# EAGLE design Nixieclock (EAGLE 7.2.0)
CNAME: http://niekproductions.com/; CREVISION: 1.0; DESIGNER: Niek Blankers
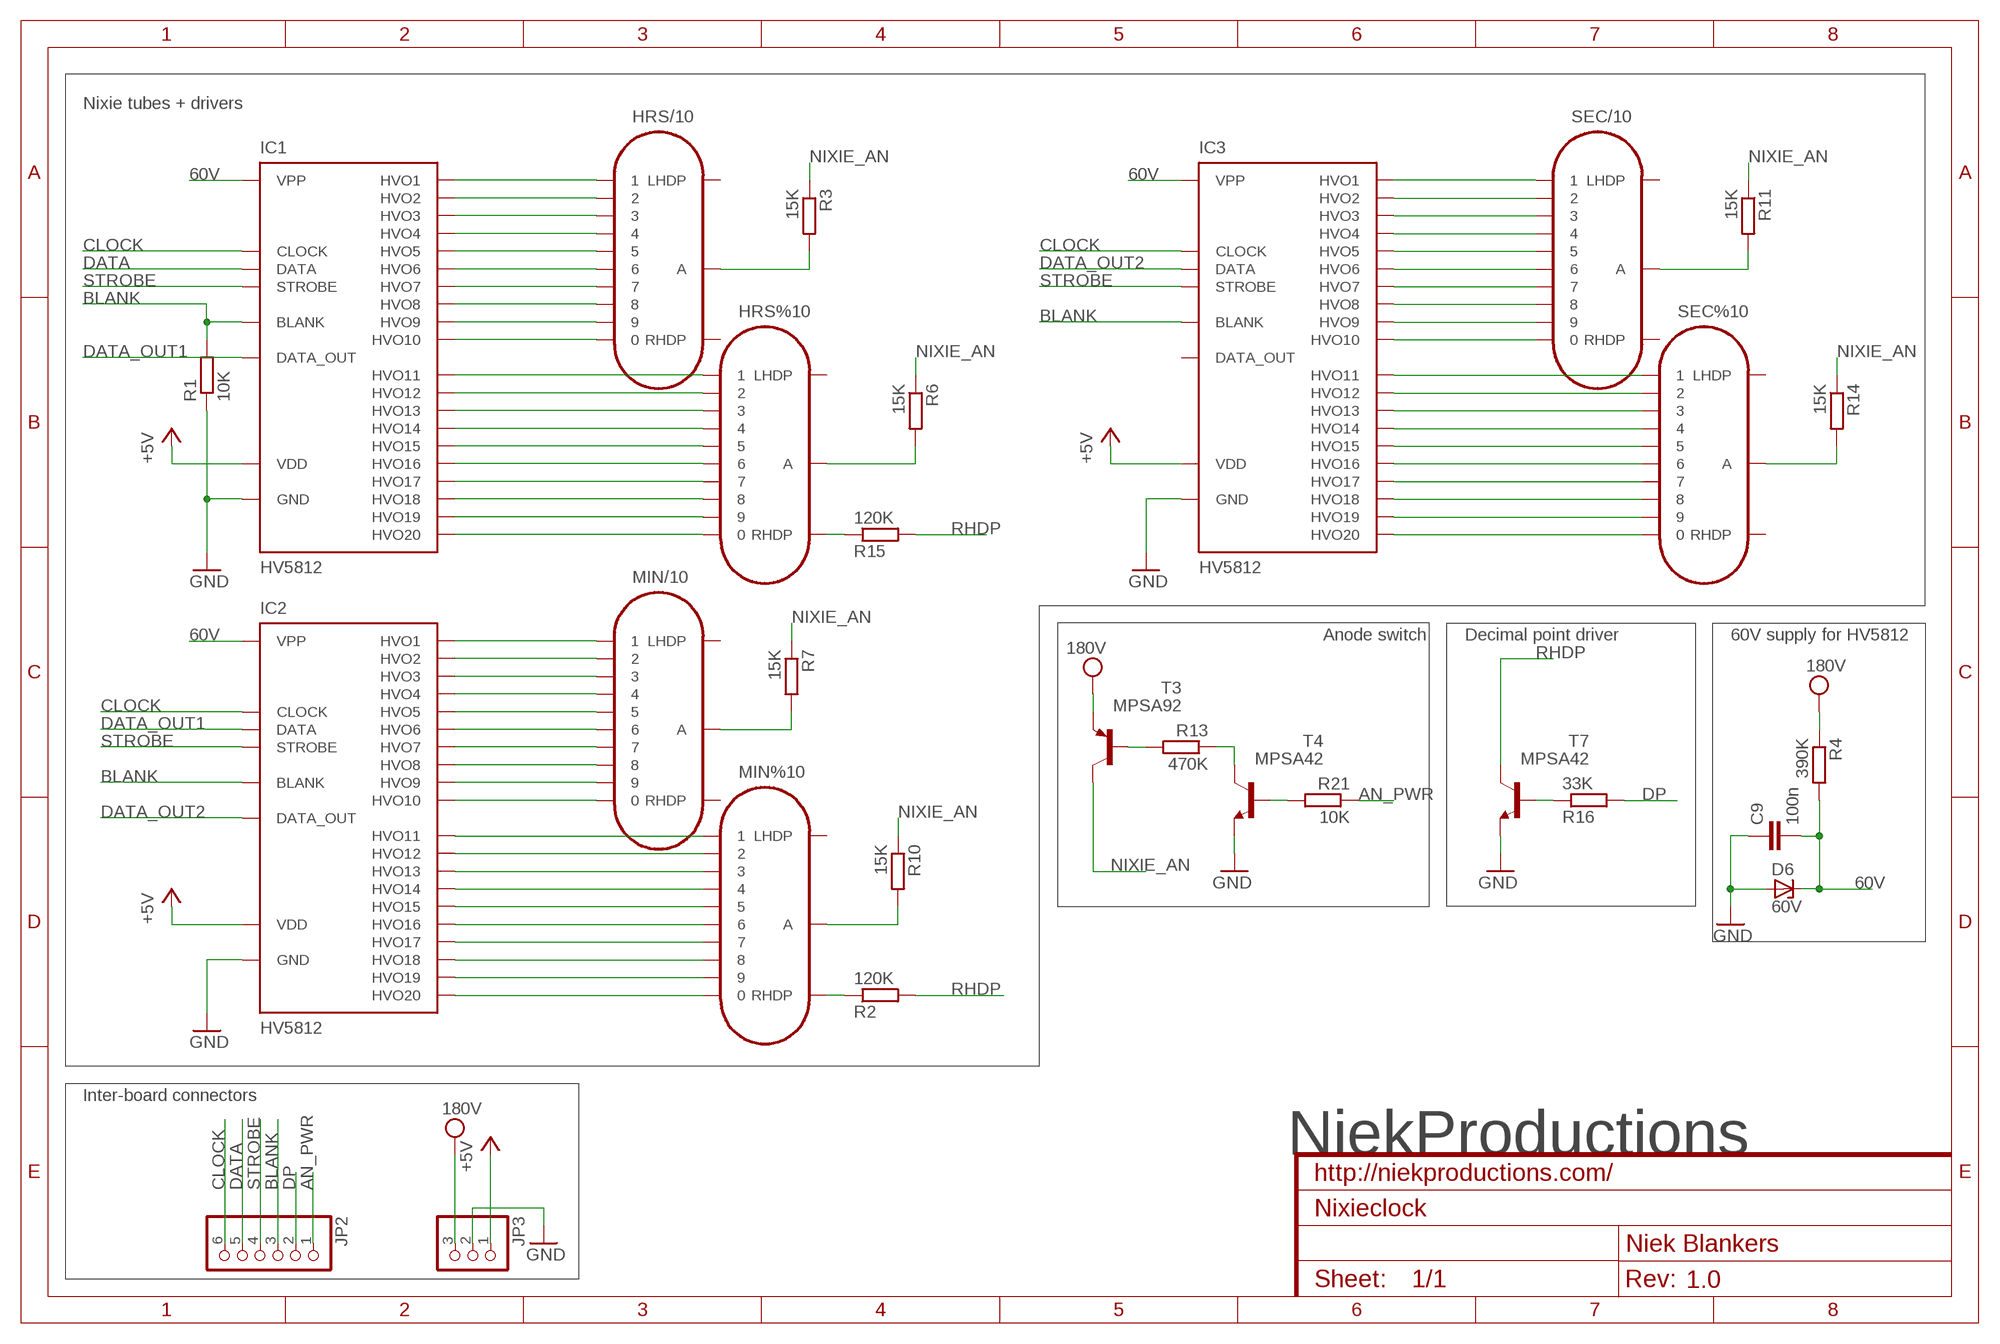
[diagram p0: schematic, sheet 1]

## Parts
C9  100n  C-EU025-025X050  [C025-025X050]
D6  60V  ZENER-DIODEF126-12  [F126Z12]
HRS%10  IN-14  [IN-14]
HRS/10  IN-14  [IN-14]
IC1  HV5812  [PLCC-28-SMD]
IC2  HV5812  [PLCC-28-SMD]
IC3  HV5812  [PLCC-28-SMD]
JP2  PINHD-1X6  [1X06]
JP3  PINHD-1X3  [1X03]
MIN%10  IN-14  [IN-14]
MIN/10  IN-14  [IN-14]
R1  10K  R-EU_0207/12  [0207/12]
R2  120K  R-EU_0207/12  [0207/12]
R3  15K  R-EU_0207/12  [0207/12]
R4  390K  R-EU_0207/12  [0207/12]
R6  15K  R-EU_0207/12  [0207/12]
R7  15K  R-EU_0207/12  [0207/12]
R10  15K  R-EU_0207/12  [0207/12]
R11  15K  R-EU_0207/12  [0207/12]
R13  470K  R-EU_0207/12  [0207/12]
R14  15K  R-EU_0207/12  [0207/12]
R15  120K  R-EU_0207/12  [0207/12]
R16  33K  R-EU_0207/12  [0207/12]
R21  10K  R-EU_0207/12  [0207/12]
SEC%10  IN-14  [IN-14]
SEC/10  IN-14  [IN-14]
T3  MPSA92  MPSA92-PNP-TO92-EBC  [TO92-EBC]
T4  MPSA42  -NPN-TO92-EBC  [TO92-EBC]
T7  MPSA42  -NPN-TO92-EBC  [TO92-EBC]
U$4  NPLOGO1CM-DIA  [NPLOGO-1CM]

## Nets
60V: C9.2 D6.C IC1.1(VPP) IC2.1(VPP) IC3.1(VPP) R4.2
+5V: IC1.28(VDD) IC2.28(VDD) IC3.28(VDD) JP3.1
AN_PWR: JP2.1 R21.1
BLANK: IC1.13(BLANK) IC2.13(BLANK) IC3.13(BLANK) JP2.3 R1.2
CLOCK: IC1.15(CLOCK) IC2.15(CLOCK) IC3.15(CLOCK) JP2.6
DATA: IC1.27(DATA) JP2.5
DATA_OUT1: IC1.2(DATA_OUT) IC2.27(DATA)
DATA_OUT2: IC2.2(DATA_OUT) IC3.27(DATA)
DP: JP2.2 R16.2
GND: C9.1 D6.A IC1.14(GND) IC2.14(GND) IC3.14(GND) JP3.2 R1.1 T4.E T7.E
HVO1: HRS/10.1 IC1.26(HVO1)
HVO2: HRS/10.2 IC1.25(HVO2)
HVO3: HRS/10.3 IC1.24(HVO3)
HVO4: HRS/10.4 IC1.23(HVO4)
HVO5: HRS/10.5 IC1.22(HVO5)
HVO6: HRS/10.6 IC1.21(HVO6)
HVO7: HRS/10.7 IC1.20(HVO7)
HVO8: HRS/10.8 IC1.19(HVO8)
HVO9: HRS/10.9 IC1.18(HVO9)
HVO10: HRS/10.0 IC1.17(HVO10)
HVO20: IC2.3(HVO20) MIN%10.0
N$1: HRS%10.RHDP R15.1
N$2: MIN%10.RHDP R2.1
N$4: R16.1 T7.B
N$12: R13.2 T3.B
N$13: HRS/10.A R3.2
N$16: IC3.25(HVO2) SEC/10.2
N$17: IC3.23(HVO4) SEC/10.4
N$19: R13.1 T4.C
N$20: R21.2 T4.B
N$21: MIN/10.A R7.2
N$23: R11.2 SEC/10.A
N$26: IC3.22(HVO5) SEC/10.5
N$28: HRS%10.A R6.2
N$29: IC3.21(HVO6) SEC/10.6
N$30: IC3.20(HVO7) SEC/10.7
N$31: IC3.19(HVO8) SEC/10.8
N$32: IC3.18(HVO9) SEC/10.9
N$33: IC3.17(HVO10) SEC/10.0
N$34: IC3.12(HVO11) SEC%10.1
N$35: IC3.11(HVO12) SEC%10.2
N$36: IC3.10(HVO13) SEC%10.3
N$37: IC3.9(HVO14) SEC%10.4
N$38: IC3.8(HVO15) SEC%10.5
N$39: IC3.7(HVO16) SEC%10.6
N$40: IC3.6(HVO17) SEC%10.7
N$41: IC3.5(HVO18) SEC%10.8
N$42: IC3.4(HVO19) SEC%10.9
N$43: MIN%10.A R10.2
N$44: IC3.24(HVO3) SEC/10.3
N$45: IC3.3(HVO20) SEC%10.0
N$46: IC3.26(HVO1) SEC/10.1
N$47: HRS%10.0 IC1.3(HVO20)
N$48: HRS%10.9 IC1.4(HVO19)
N$49: HRS%10.8 IC1.5(HVO18)
N$50: HRS%10.7 IC1.6(HVO17)
N$51: HRS%10.5 IC1.8(HVO15)
N$52: HRS%10.6 IC1.7(HVO16)
N$53: HRS%10.3 IC1.10(HVO13)
N$54: HRS%10.4 IC1.9(HVO14)
N$55: HRS%10.1 IC1.12(HVO11)
N$56: HRS%10.2 IC1.11(HVO12)
N$57: IC2.26(HVO1) MIN/10.1
N$58: IC2.25(HVO2) MIN/10.2
N$59: R14.2 SEC%10.A
N$60: IC2.24(HVO3) MIN/10.3
N$61: IC2.23(HVO4) MIN/10.4
N$62: IC2.22(HVO5) MIN/10.5
N$63: IC2.21(HVO6) MIN/10.6
N$64: IC2.20(HVO7) MIN/10.7
N$65: IC2.19(HVO8) MIN/10.8
N$66: IC2.18(HVO9) MIN/10.9
N$67: IC2.17(HVO10) MIN/10.0
N$68: IC2.12(HVO11) MIN%10.1
N$69: IC2.11(HVO12) MIN%10.2
N$70: IC2.10(HVO13) MIN%10.3
N$71: IC2.9(HVO14) MIN%10.4
N$72: IC2.8(HVO15) MIN%10.5
N$73: IC2.7(HVO16) MIN%10.6
N$74: IC2.6(HVO17) MIN%10.7
N$75: IC2.5(HVO18) MIN%10.8
N$76: IC2.4(HVO19) MIN%10.9
NIXIE_AN: R3.1 R6.1 R7.1 R10.1 R11.1 R14.1 T3.C
RHDP: R2.2 R15.2 T7.C
STROBE: IC1.16(STROBE) IC2.16(STROBE) IC3.16(STROBE) JP2.4
VPP: JP3.3 R4.1 T3.E ; supply symbol labelled 180V
Unconnected: HRS%10.LHDP HRS/10.LHDP HRS/10.RHDP IC3.2(DATA_OUT) MIN%10.LHDP MIN/10.LHDP MIN/10.RHDP SEC%10.LHDP SEC%10.RHDP SEC/10.LHDP SEC/10.RHDP

## Notes on the sheet
- Nixie tubes + drivers
- Anode switch | Decimal point driver | 60V supply for HV5812
- Inter-board connectors

## Library data of the parts
C9 = resistor:C-EU: CAPACITOR, European symbol
D6 = diode:ZENER-DIODE: Z-Diode
HRS%10 HRS/10 MIN%10 MIN/10 SEC%10 SEC/10 = russian-nixies:IN-14: IN-14: medium numeric frontview nixie tube
IC1-IC3 = supertex:HV5812
JP2 = pinhead:PINHD-1X6: PIN HEADER
JP3 = pinhead:PINHD-1X3: PIN HEADER
R1-R4 R6 R7 R10 R11 R13-R16 R21 = resistor:R-EU_: RESISTOR, European symbol
T3 = transistor:*-PNP-: PNP Transistror
T4 T7 = transistor:*-NPN-: NPN Transistror BF959 corrected 2008.03.06
U$4 = NPlogo:NPLOGO

## Board
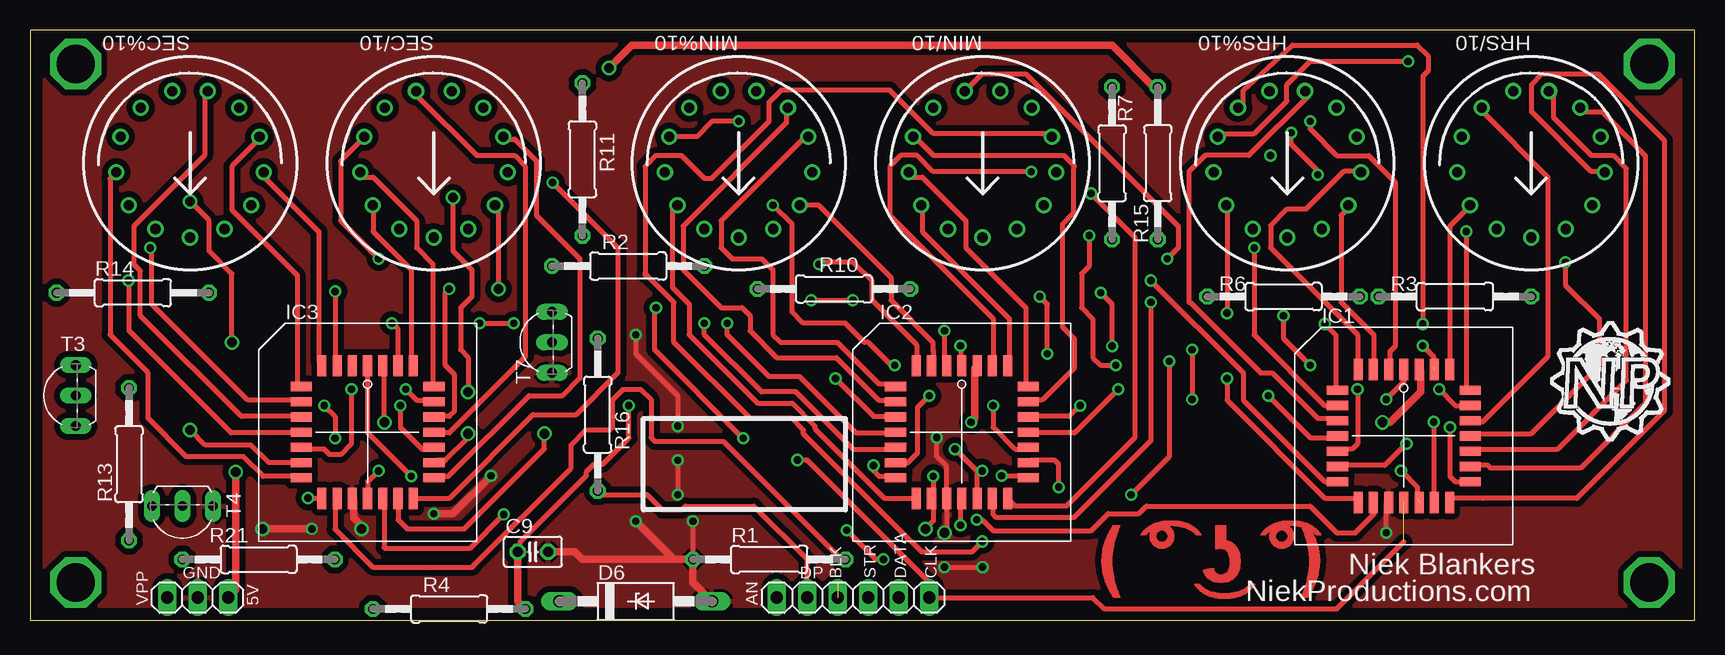
[diagram p1: board, top side]
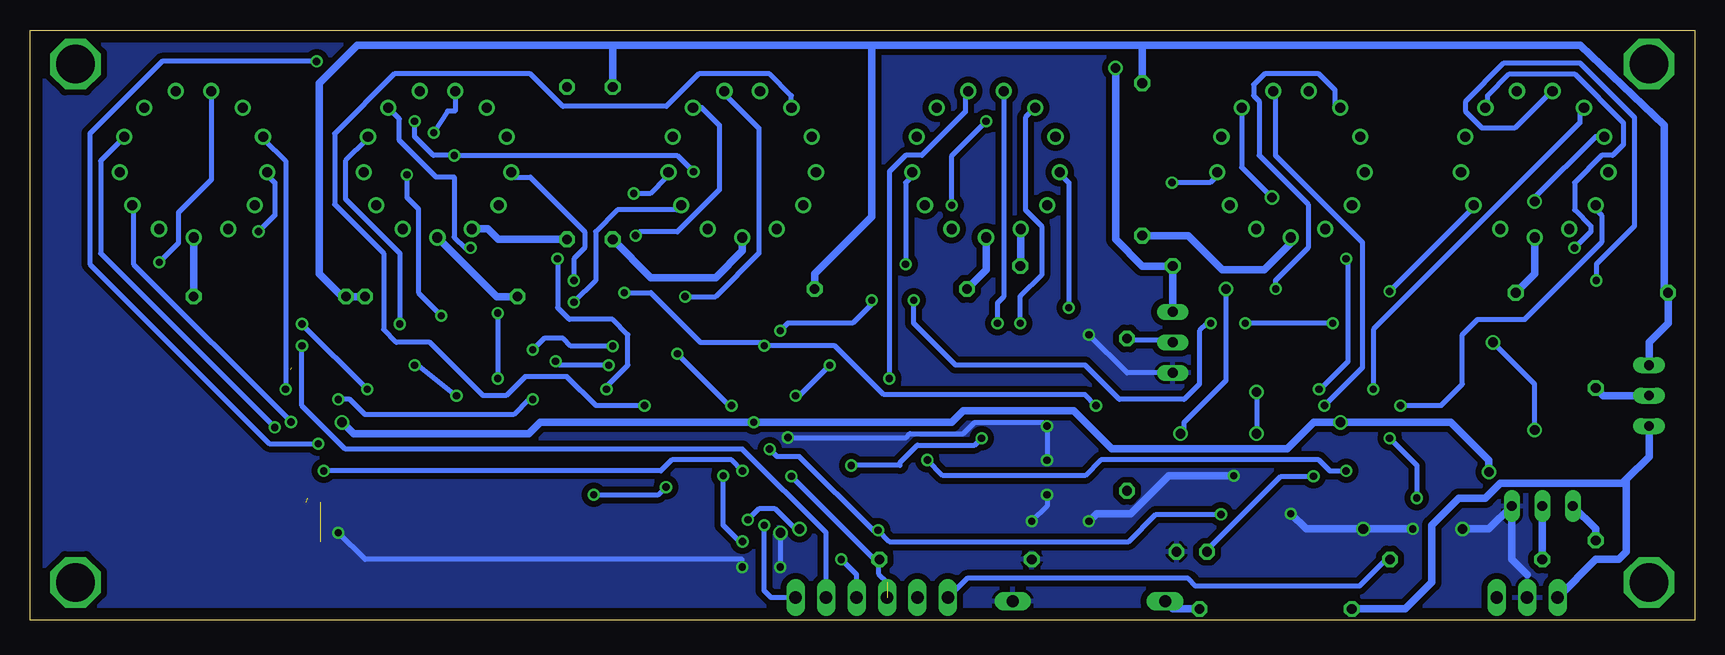
[diagram p2: board, bottom side, seen from below]

Size 138.73 x 49.2 mm. Coordinates in mm from the lower left corner, seen from the top.
Outline: 0,0 138.73,0 138.73,49.2 0,49.2 0,0
Copper layers (1*16): Top 0.035mm / dielectric 1.53mm / Bottom 0.035mm
Design rules "default *": minimum track width 16mil, minimum drill 24mil, track to track 0.5mm, track to pad 0.5mm, pad to pad 8mil, via to via 8mil, smd to smd 8mil, copper to edge 40mil, drill to drill 8mil, minimum pad ring 10mil, minimum via ring 8mil, stop-mask expansion 4mil, vias tented up to drill 32mil, thermal gap 10mil

### Footprints (pad centres in the part's own frame; a part is rotated, then mirrored left to right if it is on the bottom)
C025-025X050 = drill 0.813 octagon: 1 -1.27,0; 2 1.27,0
F126Z12 = drill 1.016 long: A 6.35,0; C -6.35,0
IN-14 = drill 0.84: 0 5.094,-3.516; 1 -5.094,-3.516; 2 -6.145,-0.746; 3 -5.788,2.195; 4 -4.105,4.633; 5 -1.481,6.01; 6 1.481,6.01; 7 4.105,4.633; 8 5.788,2.195; 9 6.145,-0.746; A 0,-6.19; LHDP 2.877,-5.481; RHDP -2.877,-5.481
PLCC-28-SMD = smd 1.778 x 0.762: 1 3.543,9.081; 2 3.543,7.811; 3 3.543,6.54; 4 3.543,5.271; 12 14.618,5.271; 13 14.618,6.54; 14 14.618,7.811; 15 14.618,9.081; 16 14.618,10.351; 17 14.618,11.62; 18 14.618,12.89; 26 3.543,12.89; 27 3.543,11.62; 28 3.543,10.351 | smd 0.762 x 1.778: 5 5.271,3.556; 6 6.54,3.556; 7 7.811,3.556; 8 9.081,3.556; 9 10.351,3.556; 10 11.62,3.556; 11 12.89,3.556; 19 12.89,14.605; 20 11.62,14.605; 21 10.351,14.605; 22 9.081,14.605; 23 7.811,14.605; 24 6.54,14.605; 25 5.271,14.605
1X06 = drill 1.016 long: 1 -6.35,0; 2 -3.81,0; 3 -1.27,0; 4 1.27,0; 5 3.81,0; 6 6.35,0
1X03 = drill 1.016 long: 1 -2.54,0; 2 0,0; 3 2.54,0
0207/12 = drill 0.813 octagon: 1 -6.35,0; 2 6.35,0
TO92-EBC = drill 0.813 long: B 0,-1.27; C 2.54,-1.27; E -2.54,-1.27

### Placement (x,y rotation side)
C9  41.91,5.71 180 top
D6  50.48,1.59 0 top
HRS%10  104.78,38.1 0 top
HRS/10  125.09,38.1 0 top
IC1  105.41,24.45 270 top
IC2  68.58,24.77 270 top
IC3  19.05,24.77 270 top
JP2  68.58,1.91 0 top
JP3  13.97,1.91 180 top
MIN%10  59.05,38.1 0 top
MIN/10  79.38,38.1 0 top
R1  61.59,5.08 0 top
R2  49.85,29.53 180 top
R3  118.75,26.99 0 top
R4  34.92,0.95 0 top
R6  104.46,26.99 180 top
R7  90.17,38.1 270 top
R10  66.99,27.62 180 top
R11  46.04,38.42 270 top
R13  8.26,13.02 90 top
R14  8.57,27.3 0 top
R15  93.98,38.1 90 top
R16  47.31,17.14 270 top
R21  19.05,5.08 180 top
SEC%10  13.34,38.1 0 top
SEC/10  33.66,38.1 0 top
T3  2.54,18.73 90 top
T4  12.7,8.26 180 top
T7  42.23,23.18 90 top
U$4  126.68,14.92 0 top
U$5  [LENNY]  107.63,1.91 0 bottom

### Tracks (layer width: path | path; a pad name or v marks a point on that pad's centre or on a via)
60V  (via drill 0.6, 0.61)
  Top 0.406: v31.77,12.01 28.14,15.63 28.14,21.07 IC3.1 | v77.54,22.89 77.54,21.53 IC2.1 | v49.9,17.9 49.9,15.18 47.73,13.02 46.99,13.02 46.35,12.38 46.35,12.06 40.83,6.54 40.83,6.12 C9.2 | IC1.1 114.49,19.88 v113.03,18.41 | v90.17,22.86 90.17,26.35 v89.22,27.3 | v96.84,22.54 v96.84,18.41
  Top 0.61: C9.2 40.64,1.59 R4.2
  Bottom 0.406: v31.77,12.01 34.49,12.01 40.38,6.12 C9.2 | v49.9,17.9 50.8,18.81 67.57,18.81 71.65,22.89 v77.54,22.89 77.83,23.18 82.87,23.18 87,27.3 v89.22,27.3 | 112.71,18.41 v113.03,18.41 112.08,18.41 110.81,17.14 98.42,17.14 97.16,18.41 v96.84,18.41 | v90.17,22.86 93.66,22.86 94.3,23.5 95.89,23.5 v96.84,22.54
  Bottom 0.61: R4.2 43.5,0.95 D6.C
+5V  (via drill 0.6, 0.8)
  Top 0.406: v29.53,16.51 29.53,21.09 IC3.28
  Top 0.61: IC2.28 78.74,21.03 78.74,16.83 v78.42,16.51 | v112.71,16.51 113.35,16.51 115.89,19.05 115.89,20.78 IC1.28 | v17.14,12.38 17.14,2.54 JP3.1
  Bottom 0.61: v17.14,12.38 17.14,13.34 20.32,16.51 v29.53,16.51 31.75,16.51 33.97,14.29 48.58,14.29 51.75,17.46 60.96,17.46 61.91,16.51 v78.42,16.51 96.2,16.51 97.16,15.56 111.76,15.56 v112.71,16.51
AN_PWR
  Bottom 0.406: R21.1 25.72,5.08 27.94,2.86 41.59,2.86 42.23,3.49 60.64,3.49 JP2.1
BLANK  (via drill 0.61, 0.8)  (1 unrouted)
  Top 0.406: IC3.13 25.43,9.74 25.43,7.59 28.57,4.45 36.9,4.45 36.9,4.51 45.09,12.7 45.09,14.61 46.35,15.88 48.33,15.88 48.54,16.09 48.54,18.35 49.45,19.26 50.91,19.26 51.75,18.41 51.75,15.24 52.07,14.92 57.78,14.92 67.31,5.4 67.63,5.4 R1.2 | 67.57,5.21 R1.2 | v75.28,12.01 75.28,10.2 IC2.13 75.28,9.74 75.28,8.29 v74.61,7.62 | v78.9,8.38 79.36,8.38 80.26,7.48 88.44,7.48 89.85,8.89 92.39,8.89 93.03,9.53 106.68,9.53 108.9,7.3 110.45,7.3 111.99,8.84 111.99,9.74 IC1.13 | 68.03,4.76 R1.2
  Bottom 0.406: 68.03,4.76 v75.28,12.01 | 68.03,4.76 R1.2 | v78.9,8.38 78,9.29 76.64,9.29 74.97,7.62 v74.61,7.62 | 68.03,4.76 68.03,3.89 67.31,3.17
CLOCK  (via drill 0.61)  (1 unrouted)
  Top 0.406: v29.05,12.46 28.14,11.55 28.14,10.2 IC3.15 | v77.54,7.93 77.54,9.74 IC2.15 | v63.95,13.37 64.74,13.37 74.93,3.17 JP2.6 88.58,1.91 89.53,0.95 108.9,0.95 114.49,6.54
  Bottom 0.406: v29.05,12.46 30.41,12.46 31.32,13.37 49.5,13.37 50.8,12.06 62.64,12.06 v63.95,13.37 | v77.54,7.93 77.54,2.49 76.96,1.91 JP2.6
DATA  (via drill 0.61)  (1 unrouted)
  Top 0.406: 116.97,21.07 116.97,21.98 v116.06,22.89
  Bottom 0.406: v116.06,22.89 116.06,17.9 112.44,14.27 79.36,14.27 72.39,7.31 JP2.5
DATA_OUT1  (via drill 0.6, 0.61)
  Top 0.406: v83.44,37.39 75.28,37.39 73.92,38.75 72.56,38.75 71.65,37.84 71.65,33.76 80.26,25.15 80.26,21.53 IC2.27 | IC1.2 113.35,21.07 113.35,22.43 113.8,22.89 113.8,36.48 111.53,38.75 111.52,38.73 108.9,38.73 106.68,40.96 v106.68,41.59
  Bottom 0.406: v83.44,37.39 84.79,38.75 v103.38,38.75 105.11,38.75 106.68,40.32 v106.68,41.59
DATA_OUT2  (via drill 0.6)
  Top 0.406: IC3.27 30.67,24.26 v30.16,24.77 | v37.47,24.77 v40.32,24.77 | v76.2,24.13 76.2,21.41 IC2.2 | v65.09,26.67 v68.58,26.67
  Bottom 0.406: v30.16,24.77 v37.47,24.77 | v40.32,24.77 40.64,24.77 41.27,24.13 41.27,19.68 42.55,18.41 47.94,18.41 50.8,21.27 61.59,21.27 65.09,24.77 v65.09,26.67 | v76.2,24.13 75.56,24.77 70.17,24.77 68.58,26.35 v68.58,26.67
DP
  Top 0.406: JP2.2 64.77,5.08 60.33,9.53 54.61,9.53 54.29,9.21 52.7,9.21 51.44,10.48 47.31,10.48 R16.2
GND  (via drill 0.6, 0.8)
  Top 0.406: v76.2,7.3 76.39,7.49 IC2.14 76.39,12.83 75.56,13.65 v75.56,15.24 | 55.56,5.08 R1.1 v55.24,8.26 | v76.2,4.45 v79.38,4.45 | v50.48,23.81 50.48,22.23 53.98,18.73 v53.98,16.19 | v53.98,13.34 v53.98,10.48 | v113.03,7.3 113.03,9.64 IC1.14
  Top 0.61: v19.37,7.62 v23.5,7.62 | v27.62,7.62 27.62,7.94 26.99,8.57 26.99,10.02 IC3.14 | D6.A 55.24,3.17 R1.1 53.66,5.08 | C9.1 45.4,5.71 46.04,5.08 53.66,5.08 | v33.66,8.89 35.24,8.89 v38.42,12.06 | v50.48,8.26 53.66,5.08
  Bottom 0.406: v76.2,7.3 v76.2,4.45 | v79.38,4.45 79.38,5.08 110.81,5.08 v113.03,7.3 | T7.E 47.31,20.64 v50.48,23.81 | v53.98,13.34 v53.98,16.19 54.29,16.51 60.01,16.51 60.96,15.56 65.41,15.56 65.72,15.24 v75.56,15.24 | v53.98,10.48 53.98,9.53 v55.24,8.26
  Bottom 0.61: v23.5,7.62 v27.62,7.62 32.38,7.62 v33.66,8.89 | 13.97,3.81 15.24,5.08 T4.E 17.14,7.62 v19.37,7.62 | v38.42,12.06 43.81,12.06 46.99,8.89 49.85,8.89 v50.48,8.26
  pour Bottom (isolate 0.305): 0,0 138.75,-0.32 138.75,49.21 0,49.21
  pour Top (isolate 0.305): 0,0 138.75,0 138.75,49.21 0,49.21
HVO1
  Top 0.406: IC1.26 118.33,21.07 118.33,32.86 119.69,34.22 HRS/10.1
HVO2  (via drill 0.61)
  Top 0.406: v119.69,32.4 119.69,19.26 IC1.25
  Bottom 0.406: v119.69,32.4 118.33,33.76 118.33,36.48 118.78,36.93 HRS/10.2
HVO3  (via drill 0.61)
  Top 0.406: v117.42,19.26 118.78,17.9 119.69,17.9 IC1.24
  Bottom 0.406: v117.42,19.26 117.42,38.29 119.24,40.11 HRS/10.3
HVO4
  Top 0.406: IC1.23 120.14,16.54 121.05,16.54 126.49,21.98 126.49,36.93 121.05,42.37 HRS/10.4
HVO5  (via drill 0.6)
  Top 0.406: v127.95,29.84 127.95,27.94 130.81,25.08 130.81,21.27 125.09,15.56 120.21,15.56 IC1.22
  Bottom 0.406: HRS/10.5 123.61,36.72 126.36,33.97 126.36,31.43 v127.95,29.84
HVO6
  Top 0.406: IC1.21 120.14,14.27 127.31,14.27 133.03,20 133.03,37.64 131.93,38.75 130.11,38.75 126.94,41.92 126.94,43.73 HRS/10.6
HVO7
  Top 0.406: IC1.20 120.14,12.91 121.5,12.91 121.72,12.7 129.22,12.7 134.62,18.1 134.62,38.73 133.74,39.62 133.74,39.65 131.02,42.37 129.21,42.37 HRS/10.7
HVO8  (via drill 0.61)
  Top 0.406: v118.33,16.09 118.33,12.01 118.78,11.55 119.69,11.55 IC1.19
  Bottom 0.406: v118.33,16.09 132.83,30.59 132.83,38.29 131.02,40.11 HRS/10.8
HVO9
  Top 0.406: IC1.18 118.33,10.2 121.05,10.2 121.09,10.16 128.91,10.16 136.21,17.46 136.21,40.01 130.67,45.55 126.04,45.55 125.13,44.64 125.13,42.37 130.11,37.39 131.02,37.39 HRS/10.9
HVO10  (via drill 0.61)
  Top 0.406: v116.97,16.54 116.97,10.2 IC1.17
  Bottom 0.406: v116.97,16.54 130.11,29.68 130.11,34.22 HRS/10.0
HVO20
  Top 0.406: IC2.3 75.28,21.53 75.28,22.43 75.25,22.46 75.25,23.18 71.75,26.67 71.75,28.57 65.72,34.61 64.17,34.61 MIN%10.0
N$1
  Bottom 0.61: HRS%10.RHDP 100.56,32.62 99.69,31.75 R15.1
N$2
  Bottom 0.406: 56.18,29.55 R2.1
  Bottom 0.61: MIN%10.RHDP 56.18,29.55
N$4
  Bottom 0.406: T7.B 43.55,23.34 47.15,23.34 R16.1
N$12
  Bottom 0.61: T3.B 7.62,18.73 R13.2
N$13
  Bottom 0.61: R3.2 HRS/10.A
N$16
  Top 0.406: IC3.25 33.58,19.71 33.58,29.68 32.22,31.04 32.22,33.31 28.6,36.93 27.69,36.93 SEC/10.2
N$17  (via drill 0.6)
  Top 0.406: IC3.23 34.04,16.99 34.94,16.99 35.4,17.45 35.4,20.48 34.61,21.27 34.61,27.3 v34.92,27.62
  Bottom 0.406: SEC/10.4 29.96,42.83 29.96,44.19 31.32,45.55 35.85,45.55 36.76,44.64 36.76,43.73 36.3,43.28 36.3,38.75 32.22,34.67 32.22,31.04 34.92,28.34 v34.92,27.62
N$19
  Bottom 0.61: R13.1 8.26,7.62 T4.C
N$20
  Bottom 0.61: T4.B R21.2
N$21
  Bottom 0.61: MIN/10.A 79.38,30.8 81.6,28.57 87,28.57 R7.2
N$22  (via drill 3.2)
  other vias: 134.94,3.17
N$23
  Bottom 0.61: SEC/10.A 33.66,31.43 35.88,29.21 39.37,29.21 42.23,32.07 R11.2
N$24  (via drill 3.2)
  other vias: 134.94,46.35
N$25  (via drill 3.2)
  other vias: 3.81,46.35
N$26
  Top 0.406: IC3.22 34.04,15.63 34.94,15.63 41.29,21.98 41.29,37.84 40.38,38.75 37.21,38.75 32.22,43.73 SEC/10.5
N$27  (via drill 3.2)
  other vias: 3.81,3.17
N$28
  Bottom 0.61: R6.2 99.85,26.99 HRS%10.A
N$29  (via drill 0.61)
  Top 0.406: v30.86,17.9 30.86,16.09 32.68,14.27 33.58,14.27 IC3.21
  Bottom 0.406: v30.86,17.9 27.69,21.07 27.69,31.5 34.94,38.75 34.94,43.73 SEC/10.6
N$30  (via drill 0.8)
  Top 0.406: v35.24,35.24 35.24,30.8 36.83,29.21 36.83,26.99 35.88,26.04 35.88,22.54 36.51,21.91 v36.51,19.05 | v36.51,15.56 36.51,15.24 34.61,13.34 33.85,13.34 IC3.20
  Bottom 0.406: SEC/10.7 37.76,37.76 v35.24,35.24 | v36.51,19.05 v36.51,15.56
N$31
  Top 0.406: IC3.19 34.04,12.01 34.87,12.01 41.59,18.73 44.39,18.73 45.82,20.17 45.82,30.14 42.19,33.76 42.19,38.29 40.38,40.11 39.47,40.11 SEC/10.8
N$32  (via drill 0.61)
  Top 0.406: v43.55,36.48 48.99,31.04 48.99,20.62 45.52,17.14 41.91,17.14 34.96,10.2 32.22,10.2 IC3.18
  Bottom 0.406: v43.55,36.48 40.38,36.48 39.93,36.93 SEC/10.9
N$33  (via drill 0.8)
  Top 0.406: IC3.17 30.67,8.38 31.43,7.62 36.2,7.62 42.86,14.29 v42.86,15.56 | 38.73,34.57 SEC/10.0 39.05,33.96 v39.05,27.62
  Bottom 0.406: v42.86,15.56 42.55,15.56 42.55,16.51 39.05,20 v39.05,27.62
N$34  (via drill 0.61)
  Top 0.406: v23.16,10.2 24.07,10.2 IC3.12 | v25.43,15.18 25.43,16.99 v24.52,17.9
  Bottom 0.406: v23.16,10.2 23.16,12.91 v25.43,15.18 | v24.52,17.9 21.15,17.9 19.37,19.68 19.37,23.81 18.1,25.08 14.16,25.08 7.75,31.5 7.75,33.76 8.2,34.22 SEC%10.1
N$35
  Top 0.406: IC3.11 22.25,12.01 19.42,12.01 17.78,13.65 13.02,13.65 9.84,16.83 9.84,20.64 6.67,23.81 6.67,36.83 6.77,36.93 6.84,36.93 SEC%10.2
N$36  (via drill 0.8)
  Top 0.406: IC3.10 19.88,13.14 18.41,14.61 14.61,14.61 v13.34,15.88 | v16.83,23.18 16.83,28.89 14.92,30.8 14.92,33.34 v13.34,34.92
  Bottom 0.406: v13.34,15.88 13.34,19.68 v16.83,23.18 | v13.34,34.92 13.34,35.24 8.26,40.32 7.58,40.32 SEC%10.3
N$37  (via drill 0.61)
  Top 0.406: v26.79,19.26 26.79,14.73 25.88,13.82 24.97,13.82 24.52,14.27 22.71,14.27 IC3.9
  Bottom 0.406: v26.79,19.26 26.79,24.25 9.56,41.47 9.56,42.37 SEC%10.4
N$38  (via drill 0.61)
  Top 0.406: IC3.8 22.25,15.63 16.75,15.63 8.26,24.13 8.26,28.27 v8.2,28.32
  Bottom 0.406: v8.2,28.32 8.2,29.68 5.03,32.86 5.03,41.92 9.56,46.45 15.91,46.45 19.08,43.28 19.08,42.37 17.72,41.01 15,41.01 12.28,43.73 SEC%10.5
N$39
  Top 0.406: IC3.7 22.25,16.99 17.61,16.99 9.21,25.4 9.21,29.13 8.66,29.68 8.66,32.86 14.55,38.75 14.55,43.73 SEC%10.6
N$40  (via drill 0.61)
  Top 0.406: IC3.6 22.25,18.35 18.16,18.35 10.16,26.35 10.16,30.9 v10.02,31.04
  Bottom 0.406: v10.02,31.04 8.66,32.4 8.66,32.86 10.02,34.22 10.02,36.48 7.75,38.75 6.84,38.75 5.94,39.65 5.94,41.47 10.02,45.55 15.46,45.55 17.27,43.73 17.27,42.83 SEC%10.7
N$41
  Top 0.406: IC3.5 22.25,19.71 22.25,28.78 16.81,34.22 16.81,37.84 19.08,40.11 SEC%10.8
N$42
  Top 0.406: IC3.4 24.07,21.53 24.07,32.4 19.53,36.93 SEC%10.9
N$43
  Bottom 0.61: MIN%10.A 59.05,29.21 R10.2
N$44  (via drill 0.61)
  Top 0.406: v31.32,19.26 32.22,18.35 33.58,18.35 IC3.24 | v29.05,30.14 25.88,33.31 25.88,38.29 27.69,40.11 SEC/10.3
  Bottom 0.406: v31.32,19.26 31.22,19.26 28.89,21.59 28.89,29.98 v29.05,30.14
N$45  (via drill 0.61)
  Top 0.406: v25.43,27.42 25.43,21.53 IC3.3
  Bottom 0.406: v25.43,27.42 18.63,34.22 SEC%10.0
N$46
  Top 0.406: IC3.26 31.77,21.53 31.77,29.23 28.6,32.4 28.6,34.22 SEC/10.1
N$47
  Top 0.406: IC1.3 111.99,21.07 111.99,23.79 109.27,26.51 109.27,33.76 109.72,34.22 HRS%10.0
N$48
  Top 0.406: IC1.4 110.63,21.07 110.63,23.79 103.38,31.04 103.38,32.89 104.78,34.29 106.36,34.29 109.54,37.47 110.81,37.47 HRS%10.9
N$49  (via drill 0.61)
  Top 0.406: v107.91,24.7 108.81,23.79 108.81,19.26 IC1.5
  Bottom 0.406: v107.91,24.7 107.91,30.59 112.44,35.12 112.44,38.29 110.63,40.11 HRS%10.8
N$50  (via drill 0.61)
  Top 0.406: v102.02,31.04 102.02,23.79 107.91,17.9 108.81,17.9 IC1.6
  Bottom 0.406: v102.02,31.04 102.47,31.04 103.38,31.95 103.38,36.93 104.88,36.93 107.95,40.01 107.95,41.8 HRS%10.7
N$51  (via drill 0.6)
  Top 0.406: v104.46,25.4 104.46,23.5 v106.68,21.27 | v103.19,18.73 106.68,15.24 108.84,15.24 IC1.8 | v107.31,37.15 107.31,37.47 105.09,39.69 v105.09,40.64
  Bottom 0.406: HRS%10.5 103.29,42.44 103.93,42.44 v105.09,40.64 | v107.31,37.15 107.31,35.24 106.36,34.29 106.36,27.3 v104.46,25.4 | v106.68,21.27 106.36,21.27 v103.19,18.73
N$52
  Top 0.406: 108.81,16.54 IC1.7 108.78,16.83 107.31,16.83 103.5,20.64 102.55,20.64 96.68,26.51 96.58,26.51 96.58,37.39 97.94,38.75 101.56,38.75 106.55,43.73 HRS%10.6
N$53  (via drill 0.61)
  Top 0.406: v114.71,14.73 112.89,12.91 109.27,12.91 IC1.10 | v114.84,46.59 106.68,46.59 104.73,44.64 104.73,43.28 102.02,40.56 99.3,40.56 HRS%10.3
  Bottom 0.406: v114.71,14.73 118.78,14.73 133.74,29.68 133.74,40.56 127.71,46.59 v114.84,46.59
N$54  (via drill 0.61)
  Top 0.406: v110.63,19.26 110.63,14.73 110.17,14.27 109.27,14.27 IC1.9 | v116.06,24.7 116.06,45.36 116.52,45.82 116.52,47.04 115.61,47.95 105.19,47.95 101.11,44.19 101.11,42.83 HRS%10.4
  Bottom 0.406: v116.06,24.7 v110.63,19.26
N$55  (via drill 0.61)
  Top 0.406: v99.75,20.17 99.75,18.35 107.91,10.2 110.63,10.2 IC1.12 | v99.75,25.61 99.75,34.22 HRS%10.1
  Bottom 0.406: v99.75,25.61 v99.75,20.17
N$56  (via drill 0.61)
  Top 0.406: v93.41,28.32 101.11,20.62 101.11,18.35 107.91,11.55 108.81,11.55 IC1.11
  Bottom 0.406: v93.41,28.32 93.41,30.14 92.5,31.04 92.5,32.4 97.03,36.93 98.39,36.93 HRS%10.2
N$57
  Top 0.406: IC2.26 81.62,21.53 81.62,25.15 74.37,32.4 74.37,34.22 MIN/10.1
N$58
  Top 0.406: IC2.25 82.98,19.71 82.98,26.06 78,31.04 78,33.31 74.37,36.93 73.47,36.93 MIN/10.2
N$59
  Bottom 0.61: SEC%10.A 13.34,28.89 R14.2
N$60
  Top 0.406: IC2.24 83.44,18.35 84.34,18.35 87.06,21.07 87.06,23.43 86.04,24.45 86.04,33.02 87,33.97 87,37.77 87.06,37.84 86.15,38.75 75.28,38.75 73.92,40.11 MIN/10.3
N$61  (via drill 0.61)
  Top 0.406: v87.51,17.9 86.61,16.99 83.44,16.99 IC2.23
  Bottom 0.406: MIN/10.4 75.28,42.83 75.28,43.73 77.09,45.55 82.98,45.55 85.7,42.83 94.31,42.83 97.03,45.55 108.36,45.55 113.35,40.56 113.35,34.67 109.27,30.59 109.27,24.25 108.2,23.18 105.41,23.18 100.97,18.73 99.06,18.73 97.47,20.32 93.98,20.32 91.56,17.9 v87.51,17.9
N$62  (via drill 0.61)
  Top 0.406: v90.69,19.26 87.06,15.63 83.44,15.63 IC2.22 | v94.77,30.14 95.67,31.04 95.67,32.86 82.98,45.55 79.36,45.55 78,44.19 MIN/10.5
  Bottom 0.406: v94.77,30.14 94.77,26.06 93.79,25.08 90.17,25.08 88.9,23.81 88.9,21.27 90.69,19.49 v90.69,19.26
N$63  (via drill 0.6, 0.61)
  Top 0.406: v80.26,17.9 80.26,16.09 82.08,14.27 82.98,14.27 IC2.21 | v84.77,22.23 84.77,26.35 v84.14,26.99
  Bottom 0.406: MIN/10.6 80.72,43.73 78,41.01 78,30.59 81.6,26.99 v84.14,26.99 | v80.26,17.9 80.45,17.9 v84.77,22.23
N$64  (via drill 0.6)
  Top 0.406: v88.27,32.07 88.27,29.53 87.63,28.89 87.63,26.04 88.58,25.08 88.58,21.91 89.22,21.27 v90.49,21.27 | v94.93,21.59 94.93,13.65 v91.76,10.48 | v85.72,11.11 85.72,13.02 85.41,13.34 83.38,13.34 IC2.20
  Bottom 0.406: MIN/10.7 82.74,42.73 81.28,41.27 81.28,35.88 84.77,32.38 87.95,32.38 v88.27,32.07 | v90.49,21.27 94.61,21.27 v94.93,21.59 | v91.76,10.48 86.36,10.48 v85.72,11.11
N$65  (via drill 0.6, 0.61)
  Top 0.406: 51.26,28.89 51.26,37.84 52.16,38.75 54.28,38.75 56.2,36.83 56.83,36.83 61.59,41.59 61.59,43.19 62.59,44.19 71.65,44.19 75.28,40.56 84.79,40.56 MIN/10.8 | 51.26,28.89 51.26,28.78 | 83.44,12.01 IC2.19 83,12.06 v80.96,12.06 | v79.36,6.57 78.5,5.71 74.3,5.71 73.47,6.54 73.47,6.57 73.44,6.57 64.45,15.56 64.45,15.88 63.5,16.83 60.01,16.83 53.66,23.18 53.66,26.49 51.26,28.89
  Bottom 0.406: v79.36,6.57 79.59,6.57 80.96,7.94 v80.96,12.06
N$66  (via drill 0.61)
  Top 0.406: v88.42,35.58 92.05,31.95 92.05,15.21 86.36,9.53 82.09,9.53 IC2.18 81.62,10.2
  Bottom 0.406: v88.42,35.58 87.06,35.58 85.7,36.93 MIN/10.9
N$67  (via drill 0.61)
  Top 0.406: v93.41,26.51 93.41,14.98 87,8.57 80.53,8.57 80.26,8.84 80.26,9.74 IC2.17
  Bottom 0.406: v93.41,26.51 91.59,28.32 91.59,32.4 89.78,34.22 84.79,34.22 MIN/10.0
N$68
  Top 0.406: IC2.12 73.92,10.2 71.2,10.2 65.41,15.99 65.41,16.19 63.5,18.1 60.64,18.1 54.93,23.81 54.93,26.35 53.52,27.76 53.52,34.22 MIN%10.1
N$69  (via drill 0.6, 0.61)
  Top 0.406: v70.29,12.91 70.29,12.46 70.75,12.01 72.11,12.01 IC2.11 | v52.16,26.06 52.07,25.96 52.07,22.54 59.37,15.24 v59.43,15.18
  Bottom 0.406: v70.29,12.91 66.21,12.91 66.21,13.16 64.77,14.61 60.01,14.61 v59.43,15.18 | v52.16,26.06 52.16,36.48 52.62,36.93 MIN%10.2
N$70  (via drill 0.6)
  Top 0.406: IC2.10 73.15,13.14 73.98,13.97 73.98,17.78 v74.93,18.73 | v72.07,21.27 71.75,21.27 69.85,23.18 69.53,23.18 67.94,24.77 64.45,24.77 63.5,25.72 63.5,33.02 v61.91,34.61 | v59.05,41.59 56.83,41.59 55.56,40.32 53.3,40.32 MIN%10.3
  Bottom 0.406: v74.93,18.73 74.61,18.73 v72.07,21.27 | v61.91,34.61 61.91,38.73 v59.05,41.59
N$71  (via drill 0.6)
  Top 0.406: IC2.9 72.11,14.27 68.59,14.27 63.82,19.05 60.96,19.05 56.2,23.81 v56.2,24.77
  Bottom 0.406: MIN%10.4 55.34,42.37 55.79,41.92 55.79,34.22 54.43,32.86 54.43,28.78 56.21,27 56.2,26.99 v56.2,24.77
N$72  (via drill 0.6)
  Top 0.406: IC2.8 72.11,15.63 68.82,15.63 64.14,20.32 61.59,20.32 58.1,23.81 v58.1,24.77
  Bottom 0.406: MIN%10.5 57.6,43.73 57.6,26.96 58.1,26.46 v58.1,24.77
N$73  (via drill 0.61)
  Top 0.406: v67.12,20.17 70.29,16.99 72.11,16.99 IC2.7
  Bottom 0.406: v67.12,20.17 67.12,37.39 65.76,38.75 64.4,38.75 60.77,42.37 60.77,43.73 MIN%10.6
N$74
  Top 0.406: IC2.6 72.11,18.35 70.75,18.35 67.19,21.91 62.23,21.91 60.01,24.13 60.01,25.4 59.35,26.06 57.6,26.06 54.43,29.23 54.43,32.86 63.04,41.47 63.04,42.37 MIN%10.7
N$75
  Top 0.406: IC2.5 72.11,19.71 70.75,19.71 67.28,23.18 62.55,23.18 61.91,23.81 61.91,29.21 60.99,30.14 58.51,30.14 57.6,31.04 57.6,33.31 64.4,40.11 MIN%10.8
N$76  (via drill 0.61)
  Top 0.406: IC2.4 73.92,21.53 73.92,22.92 70.17,26.67 70.17,28.26 68.58,29.84 65.92,29.84 v65.76,29.68
  Bottom 0.406: v65.76,29.68 65.76,36.48 65.31,36.93 MIN%10.9
NIXIE_AN
  Bottom 0.61: R11.1 46.04,47.94 | 46.04,47.94 9.53,47.94 2.54,41.27 2.54,27.62 R14.1 2.22,24.77 3.81,23.18 T3.C | 68.58,47.94 68.58,33.66 73.34,28.89 R10.1 | 68.58,47.94 46.04,47.94 | 90.17,47.94 111.44,47.94 114.62,44.77 114.62,28.89 112.71,26.99 R6.1 R3.1 | 90.17,47.94 68.58,47.94 | R7.1 90.17,47.94
RHDP  (via drill 0.8)
  Top 0.61: R15.2 93.66,44.45 90.17,47.94 50.16,47.94 v48.26,46.04
  Bottom 0.61: T7.C R2.2 46.04,29.53 48.26,31.75 v48.26,46.04
STROBE  (via drill 0.6, 0.61)  (1 unrouted)
  Top 0.406: IC3.16 29.5,9.74 29.5,6.06 29.53,6.03 36.67,6.03 v39.47,8.84 | 78.9,12.46 78.9,10.2 IC2.16 | v77.09,14.27 78.9,12.46 | 115.61,10.2 115.61,11.1 v114.25,12.46 | 78.9,12.46 v79.36,12.46 | v71.12,5.08 70.48,5.08 v68.06,7.51
  Bottom 0.406: v39.47,8.84 44.91,8.84 47.18,6.57 67.12,6.57 v68.06,7.51 68.47,7.51 74.61,13.65 76.47,13.65 v77.09,14.27 | v114.25,12.46 86.15,12.46 85.25,13.37 80.26,13.37 v79.36,12.46 | JP2.4 69.85,3.81 v71.12,5.08
VPP
  Bottom 0.61: 5.71,11.75 5.71,5.71 6.35,5.08 8.26,5.08 JP3.3 | R4.1 24.13,0.95 21.91,3.17 21.91,7.94 19.68,10.16 17.46,10.16 16.19,11.43 6.03,11.43 5.71,11.75 | T3.E 3.81,13.65 5.71,11.75

### Text on the board
tPlace: Niek Blankers | NiekProductions.com
tNames: GND | DP | BLK | STR | DATA | CLK | VPP | 5V | AN
tValues: HV5812 | HV5812 | HV5812 | IN-14 | Nixie clock | Top board